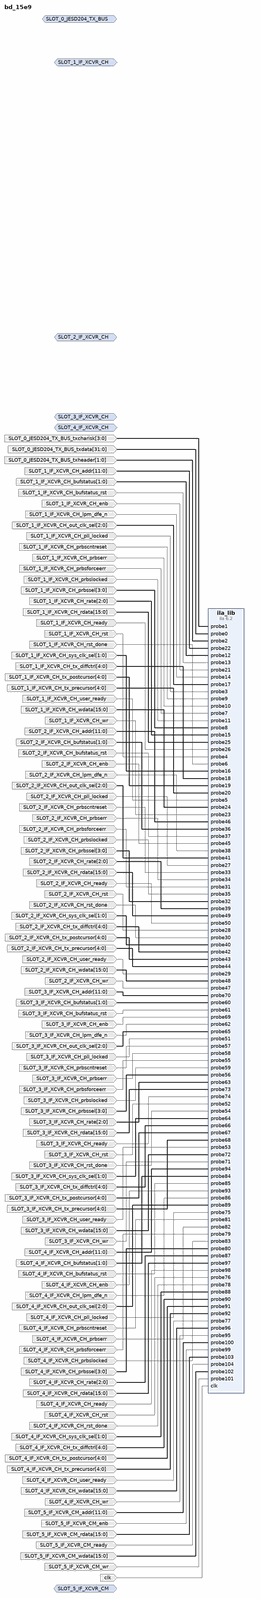
[diagram p0: block diagram of the top level, whole]
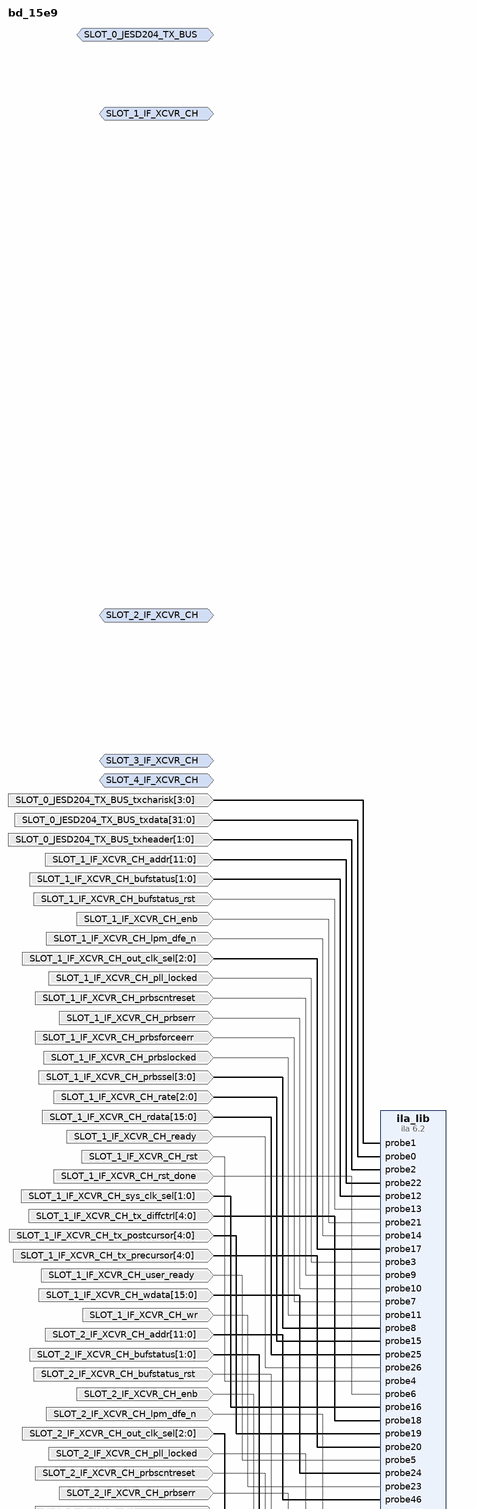
[diagram p1: block diagram of the top level, upper part]
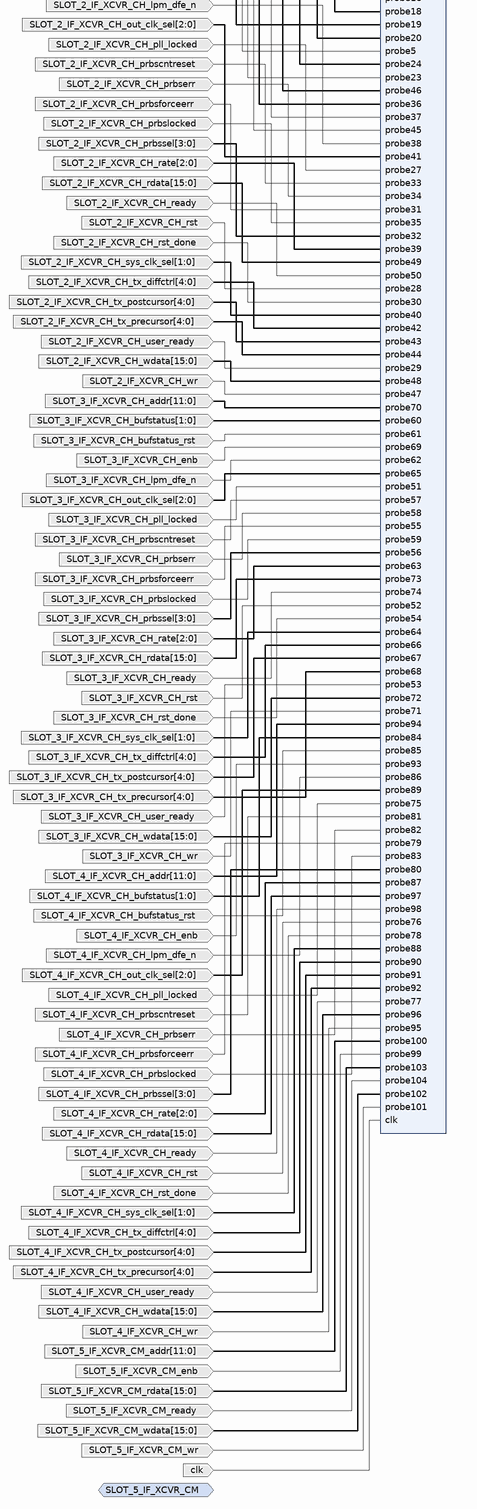
[diagram p2: block diagram of the top level, lower part]
# Vivado block design bd_15e9, xc7z045ffg900-2, Vivado 2022.2
create_bd_design bd_15e9

create_bd_intf_port -mode Monitor -vlnv xilinx.com:display_jesd204:jesd204_tx_bus_rtl:1.0 SLOT_0_JESD204_TX_BUS
create_bd_intf_port -mode Monitor -vlnv analog.com:interface:if_xcvr_ch_rtl:1.0 SLOT_1_IF_XCVR_CH
create_bd_intf_port -mode Monitor -vlnv analog.com:interface:if_xcvr_ch_rtl:1.0 SLOT_2_IF_XCVR_CH
create_bd_intf_port -mode Monitor -vlnv analog.com:interface:if_xcvr_ch_rtl:1.0 SLOT_3_IF_XCVR_CH
create_bd_intf_port -mode Monitor -vlnv analog.com:interface:if_xcvr_ch_rtl:1.0 SLOT_4_IF_XCVR_CH
create_bd_intf_port -mode Monitor -vlnv analog.com:interface:if_xcvr_cm_rtl:1.0 SLOT_5_IF_XCVR_CM
create_bd_port -dir I -type clk clk
create_bd_port -dir I -from 31 -to 0 SLOT_0_JESD204_TX_BUS_txdata
create_bd_port -dir I -from 3 -to 0 SLOT_0_JESD204_TX_BUS_txcharisk
create_bd_port -dir I -from 1 -to 0 SLOT_0_JESD204_TX_BUS_txheader
create_bd_port -dir I SLOT_1_IF_XCVR_CH_pll_locked
create_bd_port -dir I SLOT_1_IF_XCVR_CH_rst
create_bd_port -dir I SLOT_1_IF_XCVR_CH_user_ready
create_bd_port -dir I SLOT_1_IF_XCVR_CH_rst_done
create_bd_port -dir I SLOT_1_IF_XCVR_CH_prbsforceerr
create_bd_port -dir I -from 3 -to 0 SLOT_1_IF_XCVR_CH_prbssel
create_bd_port -dir I SLOT_1_IF_XCVR_CH_prbscntreset
create_bd_port -dir I SLOT_1_IF_XCVR_CH_prbserr
create_bd_port -dir I SLOT_1_IF_XCVR_CH_prbslocked
create_bd_port -dir I -from 1 -to 0 SLOT_1_IF_XCVR_CH_bufstatus
create_bd_port -dir I SLOT_1_IF_XCVR_CH_bufstatus_rst
create_bd_port -dir I SLOT_1_IF_XCVR_CH_lpm_dfe_n
create_bd_port -dir I -from 2 -to 0 SLOT_1_IF_XCVR_CH_rate
create_bd_port -dir I -from 1 -to 0 SLOT_1_IF_XCVR_CH_sys_clk_sel
create_bd_port -dir I -from 2 -to 0 SLOT_1_IF_XCVR_CH_out_clk_sel
create_bd_port -dir I -from 4 -to 0 SLOT_1_IF_XCVR_CH_tx_diffctrl
create_bd_port -dir I -from 4 -to 0 SLOT_1_IF_XCVR_CH_tx_postcursor
create_bd_port -dir I -from 4 -to 0 SLOT_1_IF_XCVR_CH_tx_precursor
create_bd_port -dir I SLOT_1_IF_XCVR_CH_enb
create_bd_port -dir I -from 11 -to 0 SLOT_1_IF_XCVR_CH_addr
create_bd_port -dir I SLOT_1_IF_XCVR_CH_wr
create_bd_port -dir I -from 15 -to 0 SLOT_1_IF_XCVR_CH_wdata
create_bd_port -dir I -from 15 -to 0 SLOT_1_IF_XCVR_CH_rdata
create_bd_port -dir I SLOT_1_IF_XCVR_CH_ready
create_bd_port -dir I SLOT_2_IF_XCVR_CH_pll_locked
create_bd_port -dir I SLOT_2_IF_XCVR_CH_rst
create_bd_port -dir I SLOT_2_IF_XCVR_CH_user_ready
create_bd_port -dir I SLOT_2_IF_XCVR_CH_rst_done
create_bd_port -dir I SLOT_2_IF_XCVR_CH_prbsforceerr
create_bd_port -dir I -from 3 -to 0 SLOT_2_IF_XCVR_CH_prbssel
create_bd_port -dir I SLOT_2_IF_XCVR_CH_prbscntreset
create_bd_port -dir I SLOT_2_IF_XCVR_CH_prbserr
create_bd_port -dir I SLOT_2_IF_XCVR_CH_prbslocked
create_bd_port -dir I -from 1 -to 0 SLOT_2_IF_XCVR_CH_bufstatus
create_bd_port -dir I SLOT_2_IF_XCVR_CH_bufstatus_rst
create_bd_port -dir I SLOT_2_IF_XCVR_CH_lpm_dfe_n
create_bd_port -dir I -from 2 -to 0 SLOT_2_IF_XCVR_CH_rate
create_bd_port -dir I -from 1 -to 0 SLOT_2_IF_XCVR_CH_sys_clk_sel
create_bd_port -dir I -from 2 -to 0 SLOT_2_IF_XCVR_CH_out_clk_sel
create_bd_port -dir I -from 4 -to 0 SLOT_2_IF_XCVR_CH_tx_diffctrl
create_bd_port -dir I -from 4 -to 0 SLOT_2_IF_XCVR_CH_tx_postcursor
create_bd_port -dir I -from 4 -to 0 SLOT_2_IF_XCVR_CH_tx_precursor
create_bd_port -dir I SLOT_2_IF_XCVR_CH_enb
create_bd_port -dir I -from 11 -to 0 SLOT_2_IF_XCVR_CH_addr
create_bd_port -dir I SLOT_2_IF_XCVR_CH_wr
create_bd_port -dir I -from 15 -to 0 SLOT_2_IF_XCVR_CH_wdata
create_bd_port -dir I -from 15 -to 0 SLOT_2_IF_XCVR_CH_rdata
create_bd_port -dir I SLOT_2_IF_XCVR_CH_ready
create_bd_port -dir I SLOT_3_IF_XCVR_CH_pll_locked
create_bd_port -dir I SLOT_3_IF_XCVR_CH_rst
create_bd_port -dir I SLOT_3_IF_XCVR_CH_user_ready
create_bd_port -dir I SLOT_3_IF_XCVR_CH_rst_done
create_bd_port -dir I SLOT_3_IF_XCVR_CH_prbsforceerr
create_bd_port -dir I -from 3 -to 0 SLOT_3_IF_XCVR_CH_prbssel
create_bd_port -dir I SLOT_3_IF_XCVR_CH_prbscntreset
create_bd_port -dir I SLOT_3_IF_XCVR_CH_prbserr
create_bd_port -dir I SLOT_3_IF_XCVR_CH_prbslocked
create_bd_port -dir I -from 1 -to 0 SLOT_3_IF_XCVR_CH_bufstatus
create_bd_port -dir I SLOT_3_IF_XCVR_CH_bufstatus_rst
create_bd_port -dir I SLOT_3_IF_XCVR_CH_lpm_dfe_n
create_bd_port -dir I -from 2 -to 0 SLOT_3_IF_XCVR_CH_rate
create_bd_port -dir I -from 1 -to 0 SLOT_3_IF_XCVR_CH_sys_clk_sel
create_bd_port -dir I -from 2 -to 0 SLOT_3_IF_XCVR_CH_out_clk_sel
create_bd_port -dir I -from 4 -to 0 SLOT_3_IF_XCVR_CH_tx_diffctrl
create_bd_port -dir I -from 4 -to 0 SLOT_3_IF_XCVR_CH_tx_postcursor
create_bd_port -dir I -from 4 -to 0 SLOT_3_IF_XCVR_CH_tx_precursor
create_bd_port -dir I SLOT_3_IF_XCVR_CH_enb
create_bd_port -dir I -from 11 -to 0 SLOT_3_IF_XCVR_CH_addr
create_bd_port -dir I SLOT_3_IF_XCVR_CH_wr
create_bd_port -dir I -from 15 -to 0 SLOT_3_IF_XCVR_CH_wdata
create_bd_port -dir I -from 15 -to 0 SLOT_3_IF_XCVR_CH_rdata
create_bd_port -dir I SLOT_3_IF_XCVR_CH_ready
create_bd_port -dir I SLOT_4_IF_XCVR_CH_pll_locked
create_bd_port -dir I SLOT_4_IF_XCVR_CH_rst
create_bd_port -dir I SLOT_4_IF_XCVR_CH_user_ready
create_bd_port -dir I SLOT_4_IF_XCVR_CH_rst_done
create_bd_port -dir I SLOT_4_IF_XCVR_CH_prbsforceerr
create_bd_port -dir I -from 3 -to 0 SLOT_4_IF_XCVR_CH_prbssel
create_bd_port -dir I SLOT_4_IF_XCVR_CH_prbscntreset
create_bd_port -dir I SLOT_4_IF_XCVR_CH_prbserr
create_bd_port -dir I SLOT_4_IF_XCVR_CH_prbslocked
create_bd_port -dir I -from 1 -to 0 SLOT_4_IF_XCVR_CH_bufstatus
create_bd_port -dir I SLOT_4_IF_XCVR_CH_bufstatus_rst
create_bd_port -dir I SLOT_4_IF_XCVR_CH_lpm_dfe_n
create_bd_port -dir I -from 2 -to 0 SLOT_4_IF_XCVR_CH_rate
create_bd_port -dir I -from 1 -to 0 SLOT_4_IF_XCVR_CH_sys_clk_sel
create_bd_port -dir I -from 2 -to 0 SLOT_4_IF_XCVR_CH_out_clk_sel
create_bd_port -dir I -from 4 -to 0 SLOT_4_IF_XCVR_CH_tx_diffctrl
create_bd_port -dir I -from 4 -to 0 SLOT_4_IF_XCVR_CH_tx_postcursor
create_bd_port -dir I -from 4 -to 0 SLOT_4_IF_XCVR_CH_tx_precursor
create_bd_port -dir I SLOT_4_IF_XCVR_CH_enb
create_bd_port -dir I -from 11 -to 0 SLOT_4_IF_XCVR_CH_addr
create_bd_port -dir I SLOT_4_IF_XCVR_CH_wr
create_bd_port -dir I -from 15 -to 0 SLOT_4_IF_XCVR_CH_wdata
create_bd_port -dir I -from 15 -to 0 SLOT_4_IF_XCVR_CH_rdata
create_bd_port -dir I SLOT_4_IF_XCVR_CH_ready
create_bd_port -dir I SLOT_5_IF_XCVR_CM_enb
create_bd_port -dir I -from 11 -to 0 SLOT_5_IF_XCVR_CM_addr
create_bd_port -dir I SLOT_5_IF_XCVR_CM_wr
create_bd_port -dir I -from 15 -to 0 SLOT_5_IF_XCVR_CM_wdata
create_bd_port -dir I -from 15 -to 0 SLOT_5_IF_XCVR_CM_rdata
create_bd_port -dir I SLOT_5_IF_XCVR_CM_ready

create_bd_cell -type ip -vlnv xilinx.com:ip:ila:6.2 ila_lib
set_property -dict [list \
  CONFIG.ALL_PROBE_SAME_MU TRUE \
  CONFIG.ALL_PROBE_SAME_MU_CNT 1 \
  CONFIG.C_ADV_TRIGGER FALSE \
  CONFIG.C_DATA_DEPTH 1024 \
  CONFIG.C_EN_STRG_QUAL 0 \
  CONFIG.C_EN_TIME_TAG 0 \
  CONFIG.C_ILA_CLK_FREQ 100000000 \
  CONFIG.C_INPUT_PIPE_STAGES 0 \
  CONFIG.C_MONITOR_TYPE Native \
  CONFIG.C_NUM_OF_PROBES 105 \
  CONFIG.C_PROBE0_TYPE 0 \
  CONFIG.C_PROBE0_WIDTH 32 \
  CONFIG.C_PROBE100_TYPE 0 \
  CONFIG.C_PROBE100_WIDTH 12 \
  CONFIG.C_PROBE101_TYPE 0 \
  CONFIG.C_PROBE101_WIDTH 1 \
  CONFIG.C_PROBE102_TYPE 0 \
  CONFIG.C_PROBE102_WIDTH 16 \
  CONFIG.C_PROBE103_TYPE 0 \
  CONFIG.C_PROBE103_WIDTH 16 \
  CONFIG.C_PROBE104_TYPE 0 \
  CONFIG.C_PROBE104_WIDTH 1 \
  CONFIG.C_PROBE10_TYPE 0 \
  CONFIG.C_PROBE10_WIDTH 1 \
  CONFIG.C_PROBE11_TYPE 0 \
  CONFIG.C_PROBE11_WIDTH 1 \
  CONFIG.C_PROBE12_TYPE 0 \
  CONFIG.C_PROBE12_WIDTH 2 \
  CONFIG.C_PROBE13_TYPE 0 \
  CONFIG.C_PROBE13_WIDTH 1 \
  CONFIG.C_PROBE14_TYPE 0 \
  CONFIG.C_PROBE14_WIDTH 1 \
  CONFIG.C_PROBE15_TYPE 0 \
  CONFIG.C_PROBE15_WIDTH 3 \
  CONFIG.C_PROBE16_TYPE 0 \
  CONFIG.C_PROBE16_WIDTH 2 \
  CONFIG.C_PROBE17_TYPE 0 \
  CONFIG.C_PROBE17_WIDTH 3 \
  CONFIG.C_PROBE18_TYPE 0 \
  CONFIG.C_PROBE18_WIDTH 5 \
  CONFIG.C_PROBE19_TYPE 0 \
  CONFIG.C_PROBE19_WIDTH 5 \
  CONFIG.C_PROBE1_TYPE 0 \
  CONFIG.C_PROBE1_WIDTH 4 \
  CONFIG.C_PROBE20_TYPE 0 \
  CONFIG.C_PROBE20_WIDTH 5 \
  CONFIG.C_PROBE21_TYPE 0 \
  CONFIG.C_PROBE21_WIDTH 1 \
  CONFIG.C_PROBE22_TYPE 0 \
  CONFIG.C_PROBE22_WIDTH 12 \
  CONFIG.C_PROBE23_TYPE 0 \
  CONFIG.C_PROBE23_WIDTH 1 \
  CONFIG.C_PROBE24_TYPE 0 \
  CONFIG.C_PROBE24_WIDTH 16 \
  CONFIG.C_PROBE25_TYPE 0 \
  CONFIG.C_PROBE25_WIDTH 16 \
  CONFIG.C_PROBE26_TYPE 0 \
  CONFIG.C_PROBE26_WIDTH 1 \
  CONFIG.C_PROBE27_TYPE 0 \
  CONFIG.C_PROBE27_WIDTH 1 \
  CONFIG.C_PROBE28_TYPE 0 \
  CONFIG.C_PROBE28_WIDTH 1 \
  CONFIG.C_PROBE29_TYPE 0 \
  CONFIG.C_PROBE29_WIDTH 1 \
  CONFIG.C_PROBE2_TYPE 0 \
  CONFIG.C_PROBE2_WIDTH 2 \
  CONFIG.C_PROBE30_TYPE 0 \
  CONFIG.C_PROBE30_WIDTH 1 \
  CONFIG.C_PROBE31_TYPE 0 \
  CONFIG.C_PROBE31_WIDTH 1 \
  CONFIG.C_PROBE32_TYPE 0 \
  CONFIG.C_PROBE32_WIDTH 4 \
  CONFIG.C_PROBE33_TYPE 0 \
  CONFIG.C_PROBE33_WIDTH 1 \
  CONFIG.C_PROBE34_TYPE 0 \
  CONFIG.C_PROBE34_WIDTH 1 \
  CONFIG.C_PROBE35_TYPE 0 \
  CONFIG.C_PROBE35_WIDTH 1 \
  CONFIG.C_PROBE36_TYPE 0 \
  CONFIG.C_PROBE36_WIDTH 2 \
  CONFIG.C_PROBE37_TYPE 0 \
  CONFIG.C_PROBE37_WIDTH 1 \
  CONFIG.C_PROBE38_TYPE 0 \
  CONFIG.C_PROBE38_WIDTH 1 \
  CONFIG.C_PROBE39_TYPE 0 \
  CONFIG.C_PROBE39_WIDTH 3 \
  CONFIG.C_PROBE3_TYPE 0 \
  CONFIG.C_PROBE3_WIDTH 1 \
  CONFIG.C_PROBE40_TYPE 0 \
  CONFIG.C_PROBE40_WIDTH 2 \
  CONFIG.C_PROBE41_TYPE 0 \
  CONFIG.C_PROBE41_WIDTH 3 \
  CONFIG.C_PROBE42_TYPE 0 \
  CONFIG.C_PROBE42_WIDTH 5 \
  CONFIG.C_PROBE43_TYPE 0 \
  CONFIG.C_PROBE43_WIDTH 5 \
  CONFIG.C_PROBE44_TYPE 0 \
  CONFIG.C_PROBE44_WIDTH 5 \
  CONFIG.C_PROBE45_TYPE 0 \
  CONFIG.C_PROBE45_WIDTH 1 \
  CONFIG.C_PROBE46_TYPE 0 \
  CONFIG.C_PROBE46_WIDTH 12 \
  CONFIG.C_PROBE47_TYPE 0 \
  CONFIG.C_PROBE47_WIDTH 1 \
  CONFIG.C_PROBE48_TYPE 0 \
  CONFIG.C_PROBE48_WIDTH 16 \
  CONFIG.C_PROBE49_TYPE 0 \
  CONFIG.C_PROBE49_WIDTH 16 \
  CONFIG.C_PROBE4_TYPE 0 \
  CONFIG.C_PROBE4_WIDTH 1 \
  CONFIG.C_PROBE50_TYPE 0 \
  CONFIG.C_PROBE50_WIDTH 1 \
  CONFIG.C_PROBE51_TYPE 0 \
  CONFIG.C_PROBE51_WIDTH 1 \
  CONFIG.C_PROBE52_TYPE 0 \
  CONFIG.C_PROBE52_WIDTH 1 \
  CONFIG.C_PROBE53_TYPE 0 \
  CONFIG.C_PROBE53_WIDTH 1 \
  CONFIG.C_PROBE54_TYPE 0 \
  CONFIG.C_PROBE54_WIDTH 1 \
  CONFIG.C_PROBE55_TYPE 0 \
  CONFIG.C_PROBE55_WIDTH 1 \
  CONFIG.C_PROBE56_TYPE 0 \
  CONFIG.C_PROBE56_WIDTH 4 \
  CONFIG.C_PROBE57_TYPE 0 \
  CONFIG.C_PROBE57_WIDTH 1 \
  CONFIG.C_PROBE58_TYPE 0 \
  CONFIG.C_PROBE58_WIDTH 1 \
  CONFIG.C_PROBE59_TYPE 0 \
  CONFIG.C_PROBE59_WIDTH 1 \
  CONFIG.C_PROBE5_TYPE 0 \
  CONFIG.C_PROBE5_WIDTH 1 \
  CONFIG.C_PROBE60_TYPE 0 \
  CONFIG.C_PROBE60_WIDTH 2 \
  CONFIG.C_PROBE61_TYPE 0 \
  CONFIG.C_PROBE61_WIDTH 1 \
  CONFIG.C_PROBE62_TYPE 0 \
  CONFIG.C_PROBE62_WIDTH 1 \
  CONFIG.C_PROBE63_TYPE 0 \
  CONFIG.C_PROBE63_WIDTH 3 \
  CONFIG.C_PROBE64_TYPE 0 \
  CONFIG.C_PROBE64_WIDTH 2 \
  CONFIG.C_PROBE65_TYPE 0 \
  CONFIG.C_PROBE65_WIDTH 3 \
  CONFIG.C_PROBE66_TYPE 0 \
  CONFIG.C_PROBE66_WIDTH 5 \
  CONFIG.C_PROBE67_TYPE 0 \
  CONFIG.C_PROBE67_WIDTH 5 \
  CONFIG.C_PROBE68_TYPE 0 \
  CONFIG.C_PROBE68_WIDTH 5 \
  CONFIG.C_PROBE69_TYPE 0 \
  CONFIG.C_PROBE69_WIDTH 1 \
  CONFIG.C_PROBE6_TYPE 0 \
  CONFIG.C_PROBE6_WIDTH 1 \
  CONFIG.C_PROBE70_TYPE 0 \
  CONFIG.C_PROBE70_WIDTH 12 \
  CONFIG.C_PROBE71_TYPE 0 \
  CONFIG.C_PROBE71_WIDTH 1 \
  CONFIG.C_PROBE72_TYPE 0 \
  CONFIG.C_PROBE72_WIDTH 16 \
  CONFIG.C_PROBE73_TYPE 0 \
  CONFIG.C_PROBE73_WIDTH 16 \
  CONFIG.C_PROBE74_TYPE 0 \
  CONFIG.C_PROBE74_WIDTH 1 \
  CONFIG.C_PROBE75_TYPE 0 \
  CONFIG.C_PROBE75_WIDTH 1 \
  CONFIG.C_PROBE76_TYPE 0 \
  CONFIG.C_PROBE76_WIDTH 1 \
  CONFIG.C_PROBE77_TYPE 0 \
  CONFIG.C_PROBE77_WIDTH 1 \
  CONFIG.C_PROBE78_TYPE 0 \
  CONFIG.C_PROBE78_WIDTH 1 \
  CONFIG.C_PROBE79_TYPE 0 \
  CONFIG.C_PROBE79_WIDTH 1 \
  CONFIG.C_PROBE7_TYPE 0 \
  CONFIG.C_PROBE7_WIDTH 1 \
  CONFIG.C_PROBE80_TYPE 0 \
  CONFIG.C_PROBE80_WIDTH 4 \
  CONFIG.C_PROBE81_TYPE 0 \
  CONFIG.C_PROBE81_WIDTH 1 \
  CONFIG.C_PROBE82_TYPE 0 \
  CONFIG.C_PROBE82_WIDTH 1 \
  CONFIG.C_PROBE83_TYPE 0 \
  CONFIG.C_PROBE83_WIDTH 1 \
  CONFIG.C_PROBE84_TYPE 0 \
  CONFIG.C_PROBE84_WIDTH 2 \
  CONFIG.C_PROBE85_TYPE 0 \
  CONFIG.C_PROBE85_WIDTH 1 \
  CONFIG.C_PROBE86_TYPE 0 \
  CONFIG.C_PROBE86_WIDTH 1 \
  CONFIG.C_PROBE87_TYPE 0 \
  CONFIG.C_PROBE87_WIDTH 3 \
  CONFIG.C_PROBE88_TYPE 0 \
  CONFIG.C_PROBE88_WIDTH 2 \
  CONFIG.C_PROBE89_TYPE 0 \
  CONFIG.C_PROBE89_WIDTH 3 \
  CONFIG.C_PROBE8_TYPE 0 \
  CONFIG.C_PROBE8_WIDTH 4 \
  CONFIG.C_PROBE90_TYPE 0 \
  CONFIG.C_PROBE90_WIDTH 5 \
  CONFIG.C_PROBE91_TYPE 0 \
  CONFIG.C_PROBE91_WIDTH 5 \
  CONFIG.C_PROBE92_TYPE 0 \
  CONFIG.C_PROBE92_WIDTH 5 \
  CONFIG.C_PROBE93_TYPE 0 \
  CONFIG.C_PROBE93_WIDTH 1 \
  CONFIG.C_PROBE94_TYPE 0 \
  CONFIG.C_PROBE94_WIDTH 12 \
  CONFIG.C_PROBE95_TYPE 0 \
  CONFIG.C_PROBE95_WIDTH 1 \
  CONFIG.C_PROBE96_TYPE 0 \
  CONFIG.C_PROBE96_WIDTH 16 \
  CONFIG.C_PROBE97_TYPE 0 \
  CONFIG.C_PROBE97_WIDTH 16 \
  CONFIG.C_PROBE98_TYPE 0 \
  CONFIG.C_PROBE98_WIDTH 1 \
  CONFIG.C_PROBE99_TYPE 0 \
  CONFIG.C_PROBE99_WIDTH 1 \
  CONFIG.C_PROBE9_TYPE 0 \
  CONFIG.C_PROBE9_WIDTH 1 \
  CONFIG.C_TIME_TAG_WIDTH 32 \
  CONFIG.C_TRIGIN_EN false \
  CONFIG.C_TRIGOUT_EN false \
  CONFIG.C_XLNX_HW_PROBE_INFO DEFAULT \
] [get_bd_cells ila_lib]

# ---- connections ----

connect_bd_net [get_bd_ports SLOT_0_JESD204_TX_BUS_txcharisk] [get_bd_pins ila_lib/probe1]
connect_bd_net [get_bd_ports SLOT_0_JESD204_TX_BUS_txdata] [get_bd_pins ila_lib/probe0]
connect_bd_net [get_bd_ports SLOT_0_JESD204_TX_BUS_txheader] [get_bd_pins ila_lib/probe2]
connect_bd_net [get_bd_ports SLOT_1_IF_XCVR_CH_addr] [get_bd_pins ila_lib/probe22]
connect_bd_net [get_bd_ports SLOT_1_IF_XCVR_CH_bufstatus] [get_bd_pins ila_lib/probe12]
connect_bd_net [get_bd_ports SLOT_1_IF_XCVR_CH_bufstatus_rst] [get_bd_pins ila_lib/probe13]
connect_bd_net [get_bd_ports SLOT_1_IF_XCVR_CH_enb] [get_bd_pins ila_lib/probe21]
connect_bd_net [get_bd_ports SLOT_1_IF_XCVR_CH_lpm_dfe_n] [get_bd_pins ila_lib/probe14]
connect_bd_net [get_bd_ports SLOT_1_IF_XCVR_CH_out_clk_sel] [get_bd_pins ila_lib/probe17]
connect_bd_net [get_bd_ports SLOT_1_IF_XCVR_CH_pll_locked] [get_bd_pins ila_lib/probe3]
connect_bd_net [get_bd_ports SLOT_1_IF_XCVR_CH_prbscntreset] [get_bd_pins ila_lib/probe9]
connect_bd_net [get_bd_ports SLOT_1_IF_XCVR_CH_prbserr] [get_bd_pins ila_lib/probe10]
connect_bd_net [get_bd_ports SLOT_1_IF_XCVR_CH_prbsforceerr] [get_bd_pins ila_lib/probe7]
connect_bd_net [get_bd_ports SLOT_1_IF_XCVR_CH_prbslocked] [get_bd_pins ila_lib/probe11]
connect_bd_net [get_bd_ports SLOT_1_IF_XCVR_CH_prbssel] [get_bd_pins ila_lib/probe8]
connect_bd_net [get_bd_ports SLOT_1_IF_XCVR_CH_rate] [get_bd_pins ila_lib/probe15]
connect_bd_net [get_bd_ports SLOT_1_IF_XCVR_CH_rdata] [get_bd_pins ila_lib/probe25]
connect_bd_net [get_bd_ports SLOT_1_IF_XCVR_CH_ready] [get_bd_pins ila_lib/probe26]
connect_bd_net [get_bd_ports SLOT_1_IF_XCVR_CH_rst] [get_bd_pins ila_lib/probe4]
connect_bd_net [get_bd_ports SLOT_1_IF_XCVR_CH_rst_done] [get_bd_pins ila_lib/probe6]
connect_bd_net [get_bd_ports SLOT_1_IF_XCVR_CH_sys_clk_sel] [get_bd_pins ila_lib/probe16]
connect_bd_net [get_bd_ports SLOT_1_IF_XCVR_CH_tx_diffctrl] [get_bd_pins ila_lib/probe18]
connect_bd_net [get_bd_ports SLOT_1_IF_XCVR_CH_tx_postcursor] [get_bd_pins ila_lib/probe19]
connect_bd_net [get_bd_ports SLOT_1_IF_XCVR_CH_tx_precursor] [get_bd_pins ila_lib/probe20]
connect_bd_net [get_bd_ports SLOT_1_IF_XCVR_CH_user_ready] [get_bd_pins ila_lib/probe5]
connect_bd_net [get_bd_ports SLOT_1_IF_XCVR_CH_wdata] [get_bd_pins ila_lib/probe24]
connect_bd_net [get_bd_ports SLOT_1_IF_XCVR_CH_wr] [get_bd_pins ila_lib/probe23]
connect_bd_net [get_bd_ports SLOT_2_IF_XCVR_CH_addr] [get_bd_pins ila_lib/probe46]
connect_bd_net [get_bd_ports SLOT_2_IF_XCVR_CH_bufstatus] [get_bd_pins ila_lib/probe36]
connect_bd_net [get_bd_ports SLOT_2_IF_XCVR_CH_bufstatus_rst] [get_bd_pins ila_lib/probe37]
connect_bd_net [get_bd_ports SLOT_2_IF_XCVR_CH_enb] [get_bd_pins ila_lib/probe45]
connect_bd_net [get_bd_ports SLOT_2_IF_XCVR_CH_lpm_dfe_n] [get_bd_pins ila_lib/probe38]
connect_bd_net [get_bd_ports SLOT_2_IF_XCVR_CH_out_clk_sel] [get_bd_pins ila_lib/probe41]
connect_bd_net [get_bd_ports SLOT_2_IF_XCVR_CH_pll_locked] [get_bd_pins ila_lib/probe27]
connect_bd_net [get_bd_ports SLOT_2_IF_XCVR_CH_prbscntreset] [get_bd_pins ila_lib/probe33]
connect_bd_net [get_bd_ports SLOT_2_IF_XCVR_CH_prbserr] [get_bd_pins ila_lib/probe34]
connect_bd_net [get_bd_ports SLOT_2_IF_XCVR_CH_prbsforceerr] [get_bd_pins ila_lib/probe31]
connect_bd_net [get_bd_ports SLOT_2_IF_XCVR_CH_prbslocked] [get_bd_pins ila_lib/probe35]
connect_bd_net [get_bd_ports SLOT_2_IF_XCVR_CH_prbssel] [get_bd_pins ila_lib/probe32]
connect_bd_net [get_bd_ports SLOT_2_IF_XCVR_CH_rate] [get_bd_pins ila_lib/probe39]
connect_bd_net [get_bd_ports SLOT_2_IF_XCVR_CH_rdata] [get_bd_pins ila_lib/probe49]
connect_bd_net [get_bd_ports SLOT_2_IF_XCVR_CH_ready] [get_bd_pins ila_lib/probe50]
connect_bd_net [get_bd_ports SLOT_2_IF_XCVR_CH_rst] [get_bd_pins ila_lib/probe28]
connect_bd_net [get_bd_ports SLOT_2_IF_XCVR_CH_rst_done] [get_bd_pins ila_lib/probe30]
connect_bd_net [get_bd_ports SLOT_2_IF_XCVR_CH_sys_clk_sel] [get_bd_pins ila_lib/probe40]
connect_bd_net [get_bd_ports SLOT_2_IF_XCVR_CH_tx_diffctrl] [get_bd_pins ila_lib/probe42]
connect_bd_net [get_bd_ports SLOT_2_IF_XCVR_CH_tx_postcursor] [get_bd_pins ila_lib/probe43]
connect_bd_net [get_bd_ports SLOT_2_IF_XCVR_CH_tx_precursor] [get_bd_pins ila_lib/probe44]
connect_bd_net [get_bd_ports SLOT_2_IF_XCVR_CH_user_ready] [get_bd_pins ila_lib/probe29]
connect_bd_net [get_bd_ports SLOT_2_IF_XCVR_CH_wdata] [get_bd_pins ila_lib/probe48]
connect_bd_net [get_bd_ports SLOT_2_IF_XCVR_CH_wr] [get_bd_pins ila_lib/probe47]
connect_bd_net [get_bd_ports SLOT_3_IF_XCVR_CH_addr] [get_bd_pins ila_lib/probe70]
connect_bd_net [get_bd_ports SLOT_3_IF_XCVR_CH_bufstatus] [get_bd_pins ila_lib/probe60]
connect_bd_net [get_bd_ports SLOT_3_IF_XCVR_CH_bufstatus_rst] [get_bd_pins ila_lib/probe61]
connect_bd_net [get_bd_ports SLOT_3_IF_XCVR_CH_enb] [get_bd_pins ila_lib/probe69]
connect_bd_net [get_bd_ports SLOT_3_IF_XCVR_CH_lpm_dfe_n] [get_bd_pins ila_lib/probe62]
connect_bd_net [get_bd_ports SLOT_3_IF_XCVR_CH_out_clk_sel] [get_bd_pins ila_lib/probe65]
connect_bd_net [get_bd_ports SLOT_3_IF_XCVR_CH_pll_locked] [get_bd_pins ila_lib/probe51]
connect_bd_net [get_bd_ports SLOT_3_IF_XCVR_CH_prbscntreset] [get_bd_pins ila_lib/probe57]
connect_bd_net [get_bd_ports SLOT_3_IF_XCVR_CH_prbserr] [get_bd_pins ila_lib/probe58]
connect_bd_net [get_bd_ports SLOT_3_IF_XCVR_CH_prbsforceerr] [get_bd_pins ila_lib/probe55]
connect_bd_net [get_bd_ports SLOT_3_IF_XCVR_CH_prbslocked] [get_bd_pins ila_lib/probe59]
connect_bd_net [get_bd_ports SLOT_3_IF_XCVR_CH_prbssel] [get_bd_pins ila_lib/probe56]
connect_bd_net [get_bd_ports SLOT_3_IF_XCVR_CH_rate] [get_bd_pins ila_lib/probe63]
connect_bd_net [get_bd_ports SLOT_3_IF_XCVR_CH_rdata] [get_bd_pins ila_lib/probe73]
connect_bd_net [get_bd_ports SLOT_3_IF_XCVR_CH_ready] [get_bd_pins ila_lib/probe74]
connect_bd_net [get_bd_ports SLOT_3_IF_XCVR_CH_rst] [get_bd_pins ila_lib/probe52]
connect_bd_net [get_bd_ports SLOT_3_IF_XCVR_CH_rst_done] [get_bd_pins ila_lib/probe54]
connect_bd_net [get_bd_ports SLOT_3_IF_XCVR_CH_sys_clk_sel] [get_bd_pins ila_lib/probe64]
connect_bd_net [get_bd_ports SLOT_3_IF_XCVR_CH_tx_diffctrl] [get_bd_pins ila_lib/probe66]
connect_bd_net [get_bd_ports SLOT_3_IF_XCVR_CH_tx_postcursor] [get_bd_pins ila_lib/probe67]
connect_bd_net [get_bd_ports SLOT_3_IF_XCVR_CH_tx_precursor] [get_bd_pins ila_lib/probe68]
connect_bd_net [get_bd_ports SLOT_3_IF_XCVR_CH_user_ready] [get_bd_pins ila_lib/probe53]
connect_bd_net [get_bd_ports SLOT_3_IF_XCVR_CH_wdata] [get_bd_pins ila_lib/probe72]
connect_bd_net [get_bd_ports SLOT_3_IF_XCVR_CH_wr] [get_bd_pins ila_lib/probe71]
connect_bd_net [get_bd_ports SLOT_4_IF_XCVR_CH_addr] [get_bd_pins ila_lib/probe94]
connect_bd_net [get_bd_ports SLOT_4_IF_XCVR_CH_bufstatus] [get_bd_pins ila_lib/probe84]
connect_bd_net [get_bd_ports SLOT_4_IF_XCVR_CH_bufstatus_rst] [get_bd_pins ila_lib/probe85]
connect_bd_net [get_bd_ports SLOT_4_IF_XCVR_CH_enb] [get_bd_pins ila_lib/probe93]
connect_bd_net [get_bd_ports SLOT_4_IF_XCVR_CH_lpm_dfe_n] [get_bd_pins ila_lib/probe86]
connect_bd_net [get_bd_ports SLOT_4_IF_XCVR_CH_out_clk_sel] [get_bd_pins ila_lib/probe89]
connect_bd_net [get_bd_ports SLOT_4_IF_XCVR_CH_pll_locked] [get_bd_pins ila_lib/probe75]
connect_bd_net [get_bd_ports SLOT_4_IF_XCVR_CH_prbscntreset] [get_bd_pins ila_lib/probe81]
connect_bd_net [get_bd_ports SLOT_4_IF_XCVR_CH_prbserr] [get_bd_pins ila_lib/probe82]
connect_bd_net [get_bd_ports SLOT_4_IF_XCVR_CH_prbsforceerr] [get_bd_pins ila_lib/probe79]
connect_bd_net [get_bd_ports SLOT_4_IF_XCVR_CH_prbslocked] [get_bd_pins ila_lib/probe83]
connect_bd_net [get_bd_ports SLOT_4_IF_XCVR_CH_prbssel] [get_bd_pins ila_lib/probe80]
connect_bd_net [get_bd_ports SLOT_4_IF_XCVR_CH_rate] [get_bd_pins ila_lib/probe87]
connect_bd_net [get_bd_ports SLOT_4_IF_XCVR_CH_rdata] [get_bd_pins ila_lib/probe97]
connect_bd_net [get_bd_ports SLOT_4_IF_XCVR_CH_ready] [get_bd_pins ila_lib/probe98]
connect_bd_net [get_bd_ports SLOT_4_IF_XCVR_CH_rst] [get_bd_pins ila_lib/probe76]
connect_bd_net [get_bd_ports SLOT_4_IF_XCVR_CH_rst_done] [get_bd_pins ila_lib/probe78]
connect_bd_net [get_bd_ports SLOT_4_IF_XCVR_CH_sys_clk_sel] [get_bd_pins ila_lib/probe88]
connect_bd_net [get_bd_ports SLOT_4_IF_XCVR_CH_tx_diffctrl] [get_bd_pins ila_lib/probe90]
connect_bd_net [get_bd_ports SLOT_4_IF_XCVR_CH_tx_postcursor] [get_bd_pins ila_lib/probe91]
connect_bd_net [get_bd_ports SLOT_4_IF_XCVR_CH_tx_precursor] [get_bd_pins ila_lib/probe92]
connect_bd_net [get_bd_ports SLOT_4_IF_XCVR_CH_user_ready] [get_bd_pins ila_lib/probe77]
connect_bd_net [get_bd_ports SLOT_4_IF_XCVR_CH_wdata] [get_bd_pins ila_lib/probe96]
connect_bd_net [get_bd_ports SLOT_4_IF_XCVR_CH_wr] [get_bd_pins ila_lib/probe95]
connect_bd_net [get_bd_ports SLOT_5_IF_XCVR_CM_addr] [get_bd_pins ila_lib/probe100]
connect_bd_net [get_bd_ports SLOT_5_IF_XCVR_CM_enb] [get_bd_pins ila_lib/probe99]
connect_bd_net [get_bd_ports SLOT_5_IF_XCVR_CM_rdata] [get_bd_pins ila_lib/probe103]
connect_bd_net [get_bd_ports SLOT_5_IF_XCVR_CM_ready] [get_bd_pins ila_lib/probe104]
connect_bd_net [get_bd_ports SLOT_5_IF_XCVR_CM_wdata] [get_bd_pins ila_lib/probe102]
connect_bd_net [get_bd_ports SLOT_5_IF_XCVR_CM_wr] [get_bd_pins ila_lib/probe101]
connect_bd_net [get_bd_ports clk] [get_bd_pins ila_lib/clk]

validate_bd_design
save_bd_design
